# Altium schematic sheet WhetherTime.SchDoc
size A4
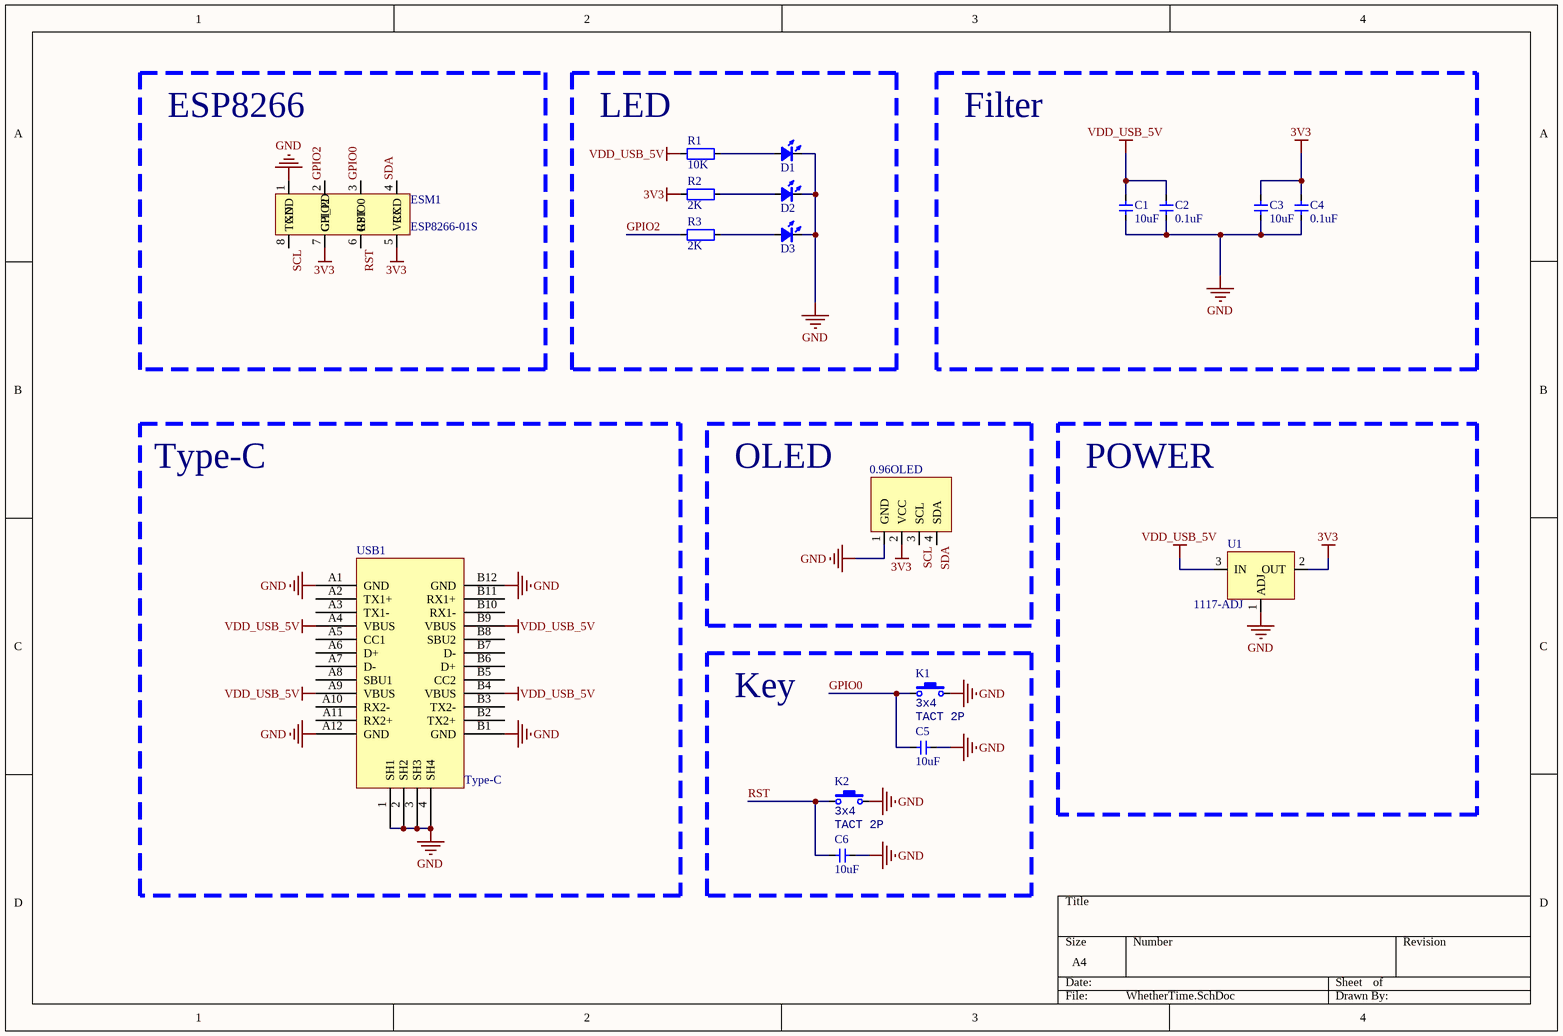
[diagram p0: WhetherTime.SchDoc]

## Parts
*1  0.96OLED  [0.96OLED_4P]
C1  10uF  [0603-CAP]
C2  0.1uF  [0603-CAP]
C3  10uF  [0603-CAP]
C4  0.1uF  [0603-CAP]
C5  10uF  [0603-CAP]
C6  10uF  [0603-CAP]
D1  color?  [LED_0402]  (value not drawn)
D2  color?  [LED_0402]  (value not drawn)
D3  color?  [LED_0402]  (value not drawn)
ESM1  ESP8266-01S  [ESP8266-01S]
K1  value 3x4  [ButtonTACT_3x4x2_180]  (hidden comment: TACT 2P)
K2  value 3x4  [ButtonTACT_3x4x2_180]  (hidden comment: TACT 2P)
R1  10K  [0603-RES]
R2  2K  [0603-RES]
R3  2K  [0603-RES]
U1  1117-ADJ  [SOT223_JX]
USB1  Type-C  [Type-C-TOP]

## Blocks framed on the sheet
ESP8266: ESM1
LED: D1-D3 R1-R3
Filter: C1-C4
Type-C: USB1
OLED: *1
POWER: U1
Key: C5 C6 K1 K2

## Nets
3V3: *1.2(VCC) C3.2 C4.2 ESM1.5(VCC) ESM1.7(CH_PD) R2.1 U1.2(OUT)
GND: *1.1(GND) C1.1 C2.1 C3.1 C4.1 C5.1 C6.1 D1.2(K) D2.2(K) D3.2(K) ESM1.1(GND) K1.2 K2.2 U1.1(ADJ) USB1.1(SH1) USB1.2(SH2) USB1.3(SH3) USB1.4(SH4) USB1.A1(GND) USB1.A12(GND) USB1.B1(GND) USB1.B12(GND)
VDD_USB_5V: C1.2 C2.2 R1.1 U1.3(IN) USB1.A4(VBUS) USB1.A9(VBUS) USB1.B4(VBUS) USB1.B9(VBUS)
GPIO0: C5.2 ESM1.3(GPIO0) K1.1
GPIO2: ESM1.2(GPIO2) R3.1
RST: C6.2 ESM1.6(RST) K2.1
SCL: *1.3(SCL) ESM1.8(TXD)
SDA: *1.4(SDA) ESM1.4(RXD)
NetD1_1: D1.1(A) R1.2
NetD2_1: D2.1(A) R2.2
NetD3_1: D3.1(A) R3.2

Not connected (* = marked no-connect by the designer): USB1 A2(TX1+) A3(TX1-) A5(CC1) A6(D+) A7(D-) A8(SBU1) A10(RX2-) A11(RX2+) B2(TX2+) B3(TX2-) B5(CC2) B6(D+) B7(D-) B8(SBU2) B10(RX1-) B11(RX1+)

## Library data of the parts
C1-C6 = 电容-0603: Capacitor; Value: 0.1u
D1-D3 = LED_0603: LED; Type: 0402; Value: color?
K1 K2 = ButtonTACT_3x4x2_180: Button; type: TACT 2P
R1-R3 = 电阻-0603: Resistor; Value: 22R
U1 = AMS1117-ADJ: IC
USB1 = USB-Type-C-TOP